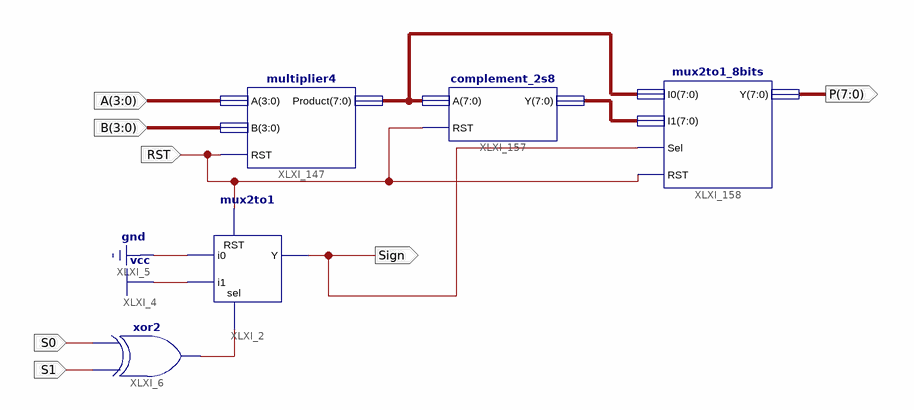
[diagram p0: schematic sheet 1]
// Xilinx ISE schematic multiplication_block.sch (artix7) as structural Verilog: 5 symbols, 7 ports
module multiplication_block (
  input  RST,
  input  S0,
  input  S1,
  input  [3:0] A,
  input  [3:0] B,
  output Sign,
  output [7:0] P
);

  wire XLXN_48;
  wire [7:0] Product, Product_bar;

  xor XLXI_6 (XLXN_48, S1, S0);
  mux2to1 XLXI_2 (.i0(1'b0), .i1(1'b1), .RST(RST), .sel(XLXN_48), .Y(Sign));
  multiplier4 XLXI_147 (.A(A), .B(B), .Product(Product), .RST(RST));
  complement_2s8 XLXI_157 (.A(Product), .RST(RST), .Y(Product_bar));
  mux2to1_8bits XLXI_158 (.I0(Product), .I1(Product_bar), .RST(RST), .Sel(Sign), .Y(P));
endmodule
